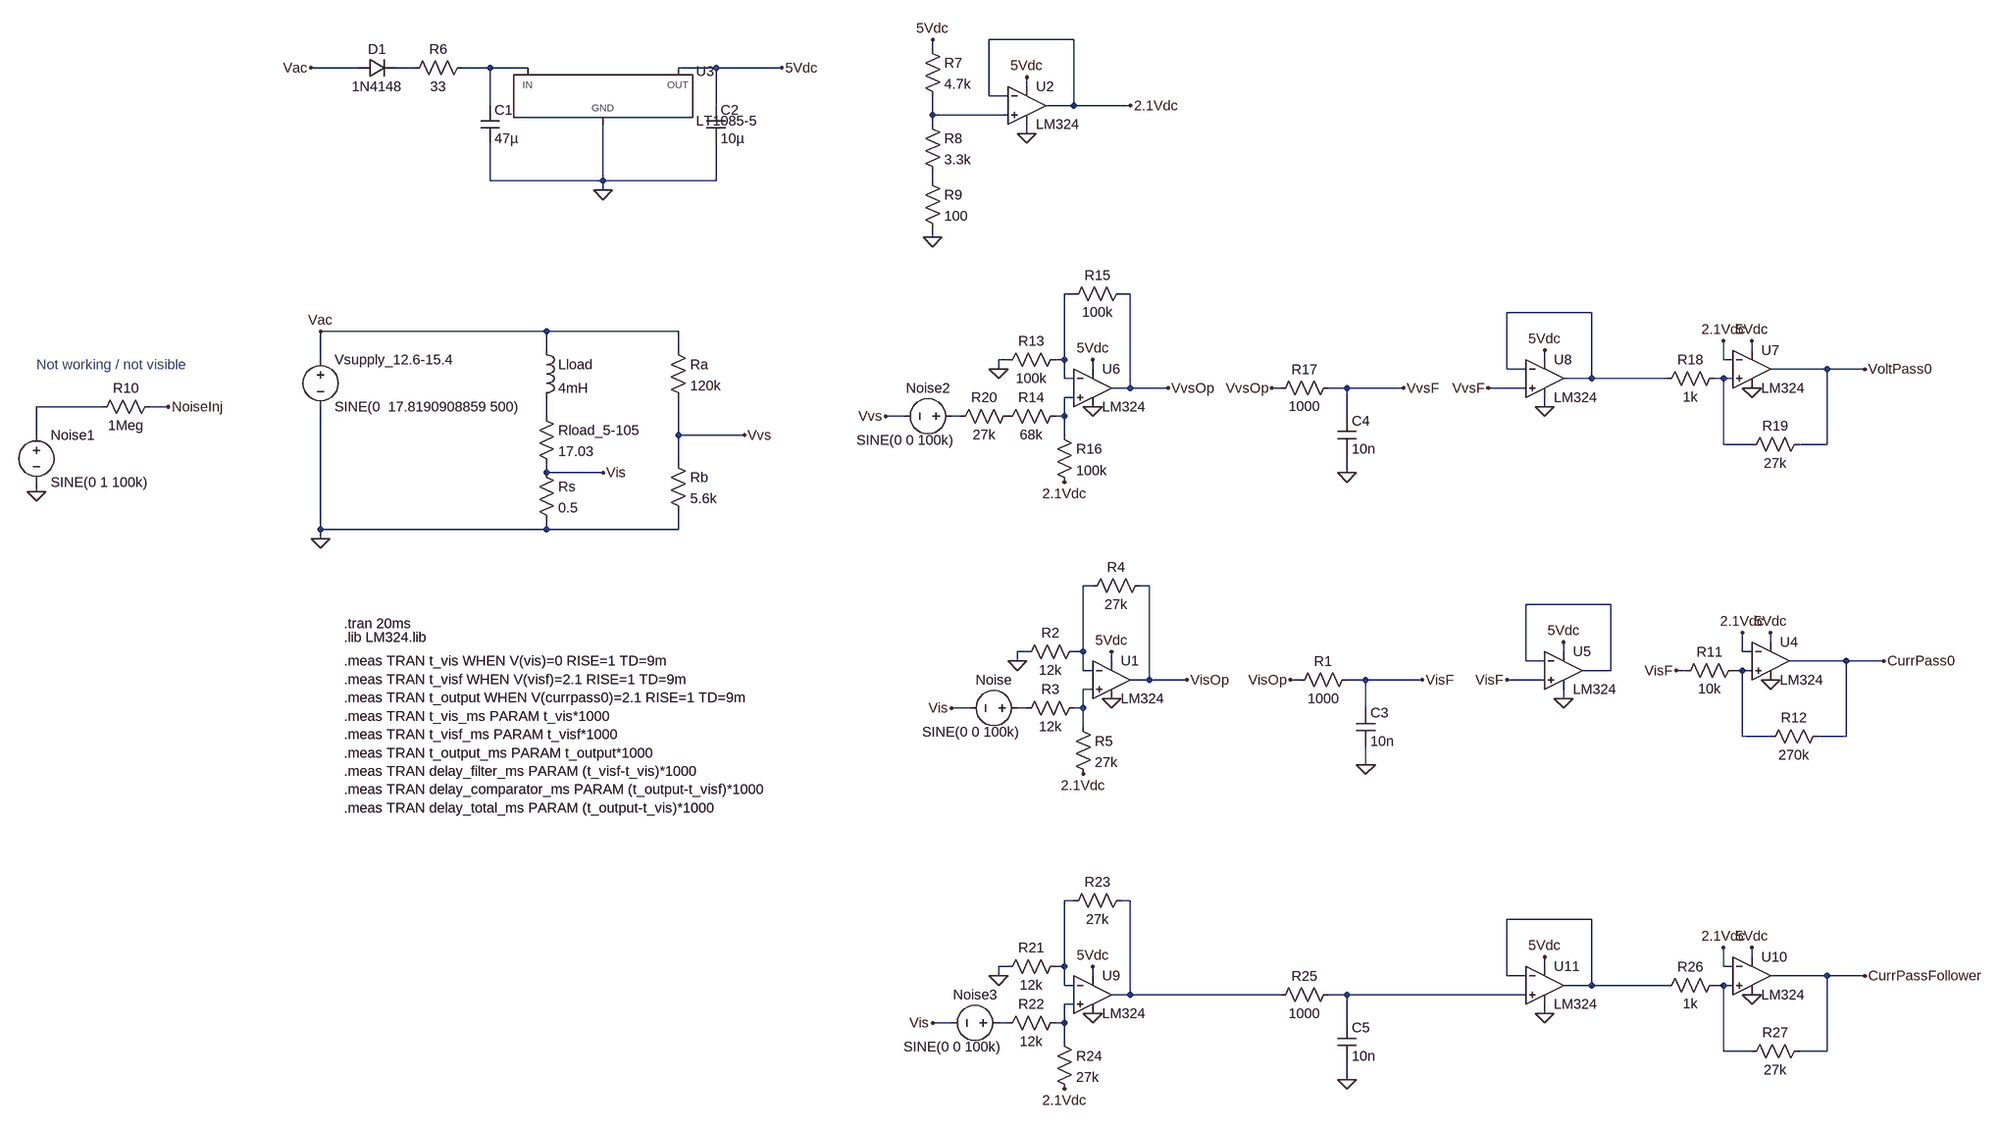
[diagram p0: schematic LTspice Simulation.asc]
LTspice Simulation.asc, the LTspice schematic file:
Version 4.1
SHEET 1 2524 1340
WIRE 960 -672 816 -672
WIRE 720 -656 720 -672
WIRE -256 -624 -336 -624
WIRE -160 -624 -192 -624
WIRE -32 -624 -80 -624
WIRE 32 -624 -32 -624
WIRE 352 -624 288 -624
WIRE 464 -624 352 -624
WIRE 880 -592 880 -608
WIRE 816 -576 816 -672
WIRE 848 -576 816 -576
WIRE -32 -560 -32 -624
WIRE 352 -560 352 -624
WIRE 960 -560 960 -672
WIRE 960 -560 912 -560
WIRE 1056 -560 960 -560
WIRE 720 -544 720 -576
WIRE 848 -544 720 -544
WIRE 720 -528 720 -544
WIRE 880 -512 880 -528
WIRE -32 -432 -32 -496
WIRE 160 -432 160 -528
WIRE 160 -432 -32 -432
WIRE 352 -432 352 -496
WIRE 352 -432 160 -432
WIRE 720 -432 720 -448
WIRE 160 -416 160 -432
WIRE 720 -336 720 -352
WIRE 960 -240 944 -240
WIRE 1056 -240 1040 -240
WIRE 1840 -208 1696 -208
WIRE 64 -176 -320 -176
WIRE 288 -176 64 -176
WIRE 64 -144 64 -176
WIRE 288 -144 288 -176
WIRE 2112 -144 2112 -160
WIRE -320 -128 -320 -176
WIRE 848 -128 832 -128
WIRE 944 -128 944 -240
WIRE 944 -128 928 -128
WIRE 1760 -128 1760 -144
WIRE 2064 -128 2064 -160
WIRE 2080 -128 2064 -128
WIRE 832 -112 832 -128
WIRE 992 -112 992 -128
WIRE 1696 -112 1696 -208
WIRE 1728 -112 1696 -112
WIRE 2240 -112 2144 -112
WIRE 2304 -112 2240 -112
WIRE 944 -96 944 -128
WIRE 960 -96 944 -96
WIRE 1840 -96 1840 -208
WIRE 1840 -96 1792 -96
WIRE 1968 -96 1840 -96
WIRE 2064 -96 2048 -96
WIRE 2080 -96 2064 -96
WIRE 1056 -80 1056 -240
WIRE 1056 -80 1024 -80
WIRE 1120 -80 1056 -80
WIRE 1312 -80 1296 -80
WIRE 1424 -80 1392 -80
WIRE 1520 -80 1424 -80
WIRE 1728 -80 1664 -80
WIRE 960 -64 944 -64
WIRE -1024 -48 -1136 -48
WIRE -912 -48 -944 -48
WIRE 1760 -48 1760 -64
WIRE 64 -32 64 -64
WIRE 672 -32 640 -32
WIRE 768 -32 752 -32
WIRE 944 -32 944 -64
WIRE 944 -32 928 -32
WIRE 1424 -32 1424 -80
WIRE -1136 0 -1136 -48
WIRE 288 0 288 -64
WIRE 400 0 288 0
WIRE 944 0 944 -32
WIRE 2064 16 2064 -96
WIRE 2112 16 2064 16
WIRE 2240 16 2240 -112
WIRE 2240 16 2192 16
WIRE 288 48 288 0
WIRE 64 64 64 48
WIRE 160 64 64 64
WIRE 1424 64 1424 32
WIRE -1136 96 -1136 80
WIRE -320 160 -320 -48
WIRE 64 160 64 144
WIRE 64 160 -320 160
WIRE 288 160 288 128
WIRE 288 160 64 160
WIRE -320 176 -320 160
WIRE 992 256 976 256
WIRE 1088 256 1072 256
WIRE 1872 288 1728 288
WIRE 2144 352 2144 336
WIRE 880 368 864 368
WIRE 976 368 976 256
WIRE 976 368 960 368
WIRE 1792 368 1792 352
WIRE 2096 368 2096 336
WIRE 2112 368 2096 368
WIRE 864 384 864 368
WIRE 1024 384 1024 368
WIRE 1728 384 1728 288
WIRE 1760 384 1728 384
WIRE 2272 384 2176 384
WIRE 2336 384 2272 384
WIRE 976 400 976 368
WIRE 992 400 976 400
WIRE 1872 400 1872 288
WIRE 1872 400 1824 400
WIRE 2000 400 1984 400
WIRE 2096 400 2080 400
WIRE 2112 400 2096 400
WIRE 1088 416 1088 256
WIRE 1088 416 1056 416
WIRE 1152 416 1088 416
WIRE 1344 416 1328 416
WIRE 1456 416 1424 416
WIRE 1552 416 1456 416
WIRE 1760 416 1696 416
WIRE 992 432 976 432
WIRE 1792 448 1792 432
WIRE 784 464 752 464
WIRE 880 464 864 464
WIRE 976 464 976 432
WIRE 976 464 960 464
WIRE 1456 464 1456 416
WIRE 976 496 976 464
WIRE 2096 512 2096 400
WIRE 2144 512 2096 512
WIRE 2272 512 2272 384
WIRE 2272 512 2224 512
WIRE 1456 560 1456 528
WIRE 960 896 944 896
WIRE 1056 896 1040 896
WIRE 1840 928 1696 928
WIRE 2112 992 2112 976
WIRE 848 1008 832 1008
WIRE 944 1008 944 896
WIRE 944 1008 928 1008
WIRE 1760 1008 1760 992
WIRE 2064 1008 2064 976
WIRE 2080 1008 2064 1008
WIRE 832 1024 832 1008
WIRE 992 1024 992 1008
WIRE 1696 1024 1696 928
WIRE 1728 1024 1696 1024
WIRE 2240 1024 2144 1024
WIRE 2304 1024 2240 1024
WIRE 944 1040 944 1008
WIRE 960 1040 944 1040
WIRE 1840 1040 1840 928
WIRE 1840 1040 1792 1040
WIRE 1968 1040 1840 1040
WIRE 2064 1040 2048 1040
WIRE 2080 1040 2064 1040
WIRE 1056 1056 1056 896
WIRE 1056 1056 1024 1056
WIRE 1312 1056 1056 1056
WIRE 1424 1056 1392 1056
WIRE 1728 1056 1424 1056
WIRE 960 1072 944 1072
WIRE 1760 1088 1760 1072
WIRE 752 1104 720 1104
WIRE 848 1104 832 1104
WIRE 944 1104 944 1072
WIRE 944 1104 928 1104
WIRE 1424 1104 1424 1056
WIRE 944 1136 944 1104
WIRE 2064 1152 2064 1040
WIRE 2112 1152 2064 1152
WIRE 2240 1152 2240 1024
WIRE 2240 1152 2192 1152
WIRE 1424 1200 1424 1168
FLAG 160 64 Vis
FLAG 400 0 Vvs
FLAG -320 176 0
FLAG -320 -176 Vac
FLAG -336 -624 Vac
FLAG 464 -624 5Vdc
FLAG 160 -416 0
FLAG 1024 368 5Vdc
FLAG 864 384 0
FLAG 752 464 Vis
FLAG 720 -336 0
FLAG 976 576 2.1Vdc
FLAG 1024 448 0
FLAG 720 -672 5Vdc
FLAG 880 -608 5Vdc
FLAG 880 -512 0
FLAG 1056 -560 2.1Vdc
FLAG 1456 560 0
FLAG 1552 416 VisF
FLAG -1136 96 0
FLAG -912 -48 NoiseInj
FLAG 1152 416 VisOp
FLAG 1328 416 VisOp
FLAG 2144 416 0
FLAG 2144 336 5Vdc
FLAG 2096 336 2.1Vdc
FLAG 2336 384 CurrPass0
FLAG 1792 352 5Vdc
FLAG 1792 448 0
FLAG 1696 416 VisF
FLAG 992 -128 5Vdc
FLAG 832 -112 0
FLAG 640 -32 Vvs
FLAG 944 80 2.1Vdc
FLAG 992 -48 0
FLAG 1424 64 0
FLAG 1520 -80 VvsF
FLAG 1120 -80 VvsOp
FLAG 1296 -80 VvsOp
FLAG 2112 -80 0
FLAG 2112 -160 5Vdc
FLAG 2064 -160 2.1Vdc
FLAG 2304 -112 VoltPass0
FLAG 1760 -144 5Vdc
FLAG 1760 -48 0
FLAG 1664 -80 VvsF
FLAG 1984 400 VisF
FLAG 992 1008 5Vdc
FLAG 832 1024 0
FLAG 720 1104 Vis
FLAG 944 1216 2.1Vdc
FLAG 992 1088 0
FLAG 1424 1200 0
FLAG 2112 1056 0
FLAG 2112 976 5Vdc
FLAG 2064 976 2.1Vdc
FLAG 2304 1024 CurrPassFollower
FLAG 1760 992 5Vdc
FLAG 1760 1088 0
SYMBOL voltage -320 -144 R0
WINDOW 123 0 0 Left 0
WINDOW 39 0 0 Left 0
SYMATTR InstName Vsupply_12.6-15.4
SYMATTR Value SINE(0  17.8190908859 500)
SYMBOL ind 48 -160 R0
SYMATTR InstName Lload
SYMATTR Value 4mH
SYMATTR SpiceLine Rser=1m
SYMBOL res 48 -48 R0
SYMATTR InstName Rload_5-105
SYMATTR Value 17.03
SYMBOL res 272 -160 R0
SYMATTR InstName Ra
SYMATTR Value 120k
SYMBOL res 272 32 R0
SYMATTR InstName Rb
SYMATTR Value 5.6k
SYMBOL res 48 48 R0
SYMATTR InstName Rs
SYMATTR Value 0.5
SYMBOL res 976 352 R90
WINDOW 0 0 56 VBottom 2
WINDOW 3 32 56 VTop 2
SYMATTR InstName R2
SYMATTR Value 12k
SYMBOL res 976 448 R90
WINDOW 0 0 56 VBottom 2
WINDOW 3 32 56 VTop 2
SYMATTR InstName R3
SYMATTR Value 12k
SYMBOL res 1088 240 R90
WINDOW 0 0 56 VBottom 2
WINDOW 3 32 56 VTop 2
SYMATTR InstName R4
SYMATTR Value 27k
SYMBOL res 960 480 R0
SYMATTR InstName R5
SYMATTR Value 27k
SYMBOL diode -256 -608 R270
WINDOW 0 32 32 VTop 2
WINDOW 3 0 32 VBottom 2
SYMATTR InstName D1
SYMATTR Value 1N4148
SYMBOL res -64 -640 R90
WINDOW 0 0 56 VBottom 2
WINDOW 3 32 56 VTop 2
SYMATTR InstName R6
SYMATTR Value 33
SYMBOL cap -48 -560 R0
SYMATTR InstName C1
SYMATTR Value 47µ
SYMBOL cap 336 -560 R0
SYMATTR InstName C2
SYMATTR Value 10µ
SYMBOL PowerProducts\\LT1085-5 160 -624 R0
SYMATTR InstName U3
SYMBOL res 704 -672 R0
SYMATTR InstName R7
SYMATTR Value 4.7k
SYMBOL res 704 -544 R0
SYMATTR InstName R8
SYMATTR Value 3.3k
SYMBOL OpAmps\\opamp2 1024 352 R0
SYMATTR InstName U1
SYMATTR Value LM324
SYMBOL res 704 -448 R0
SYMATTR InstName R9
SYMATTR Value 100
SYMBOL OpAmps\\opamp2 880 -624 R0
SYMATTR InstName U2
SYMATTR Value LM324
SYMBOL res 1440 400 R90
WINDOW 0 0 56 VBottom 2
WINDOW 3 32 56 VTop 2
SYMATTR InstName R1
SYMATTR Value 1000
SYMBOL cap 1440 464 R0
SYMATTR InstName C3
SYMATTR Value 10n
SYMBOL voltage -1136 -16 R0
WINDOW 123 0 0 Left 0
WINDOW 39 0 0 Left 0
SYMATTR InstName Noise1
SYMATTR Value SINE(0 1 100k)
SYMBOL res -928 -64 R90
WINDOW 0 0 56 VBottom 2
WINDOW 3 32 56 VTop 2
SYMATTR InstName R10
SYMATTR Value 1Meg
SYMBOL voltage 880 464 R90
WINDOW 0 -32 56 VBottom 2
WINDOW 3 56 95 VBottom 2
WINDOW 123 0 0 Left 0
WINDOW 39 0 0 Left 0
SYMATTR InstName Noise
SYMATTR Value SINE(0 0 100k)
SYMBOL OpAmps\\opamp2 2144 320 R0
SYMATTR InstName U4
SYMATTR Value LM324
SYMBOL res 2096 384 R90
WINDOW 0 0 56 VBottom 2
WINDOW 3 32 56 VTop 2
SYMATTR InstName R11
SYMATTR Value 10k
SYMBOL res 2240 496 R90
WINDOW 0 0 56 VBottom 2
WINDOW 3 32 56 VTop 2
SYMATTR InstName R12
SYMATTR Value 270k
SYMBOL OpAmps\\opamp2 1792 336 R0
SYMATTR InstName U5
SYMATTR Value LM324
SYMBOL res 944 -144 R90
WINDOW 0 0 56 VBottom 2
WINDOW 3 32 56 VTop 2
SYMATTR InstName R13
SYMATTR Value 100k
SYMBOL res 944 -48 R90
WINDOW 0 0 56 VBottom 2
WINDOW 3 32 56 VTop 2
SYMATTR InstName R14
SYMATTR Value 68k
SYMBOL res 1056 -256 R90
WINDOW 0 0 56 VBottom 2
WINDOW 3 32 56 VTop 2
SYMATTR InstName R15
SYMATTR Value 100k
SYMBOL res 928 -16 R0
SYMATTR InstName R16
SYMATTR Value 100k
SYMBOL OpAmps\\opamp2 992 -144 R0
SYMATTR InstName U6
SYMATTR Value LM324
SYMBOL res 1408 -96 R90
WINDOW 0 0 56 VBottom 2
WINDOW 3 32 56 VTop 2
SYMATTR InstName R17
SYMATTR Value 1000
SYMBOL cap 1408 -32 R0
SYMATTR InstName C4
SYMATTR Value 10n
SYMBOL voltage 768 -32 R90
WINDOW 0 -32 56 VBottom 2
WINDOW 3 56 95 VBottom 2
WINDOW 123 0 0 Left 0
WINDOW 39 0 0 Left 0
SYMATTR InstName Noise2
SYMATTR Value SINE(0 0 100k)
SYMBOL OpAmps\\opamp2 2112 -176 R0
SYMATTR InstName U7
SYMATTR Value LM324
SYMBOL res 2064 -112 R90
WINDOW 0 0 56 VBottom 2
WINDOW 3 32 56 VTop 2
SYMATTR InstName R18
SYMATTR Value 1k
SYMBOL res 2208 0 R90
WINDOW 0 0 56 VBottom 2
WINDOW 3 32 56 VTop 2
SYMATTR InstName R19
SYMATTR Value 27k
SYMBOL OpAmps\\opamp2 1760 -160 R0
SYMATTR InstName U8
SYMATTR Value LM324
SYMBOL res 864 -48 R90
WINDOW 0 0 56 VBottom 2
WINDOW 3 32 56 VTop 2
SYMATTR InstName R20
SYMATTR Value 27k
SYMBOL res 944 992 R90
WINDOW 0 0 56 VBottom 2
WINDOW 3 32 56 VTop 2
SYMATTR InstName R21
SYMATTR Value 12k
SYMBOL res 944 1088 R90
WINDOW 0 0 56 VBottom 2
WINDOW 3 32 56 VTop 2
SYMATTR InstName R22
SYMATTR Value 12k
SYMBOL res 1056 880 R90
WINDOW 0 0 56 VBottom 2
WINDOW 3 32 56 VTop 2
SYMATTR InstName R23
SYMATTR Value 27k
SYMBOL res 928 1120 R0
SYMATTR InstName R24
SYMATTR Value 27k
SYMBOL OpAmps\\opamp2 992 992 R0
SYMATTR InstName U9
SYMATTR Value LM324
SYMBOL res 1408 1040 R90
WINDOW 0 0 56 VBottom 2
WINDOW 3 32 56 VTop 2
SYMATTR InstName R25
SYMATTR Value 1000
SYMBOL cap 1408 1104 R0
SYMATTR InstName C5
SYMATTR Value 10n
SYMBOL voltage 848 1104 R90
WINDOW 0 -32 56 VBottom 2
WINDOW 3 56 95 VBottom 2
WINDOW 123 0 0 Left 0
WINDOW 39 0 0 Left 0
SYMATTR InstName Noise3
SYMATTR Value SINE(0 0 100k)
SYMBOL OpAmps\\opamp2 2112 960 R0
SYMATTR InstName U10
SYMATTR Value LM324
SYMBOL res 2064 1024 R90
WINDOW 0 0 56 VBottom 2
WINDOW 3 32 56 VTop 2
SYMATTR InstName R26
SYMATTR Value 1k
SYMBOL res 2208 1136 R90
WINDOW 0 0 56 VBottom 2
WINDOW 3 32 56 VTop 2
SYMATTR InstName R27
SYMATTR Value 27k
SYMBOL OpAmps\\opamp2 1760 976 R0
SYMATTR InstName U11
SYMATTR Value LM324
TEXT -280 320 Left 2 !.tran 20ms
TEXT -280 344 Left 2 !.lib LM324.lib
TEXT -1136 -120 Left 2 ;Not working / not visible
TEXT -280 384 Left 2 !.meas TRAN t_vis WHEN V(vis)=0 RISE=1 TD=9m\n.meas TRAN t_visf WHEN V(visf)=2.1 RISE=1 TD=9m\n.meas TRAN t_output WHEN V(currpass0)=2.1 RISE=1 TD=9m\n.meas TRAN t_vis_ms PARAM t_vis*1000\n.meas TRAN t_visf_ms PARAM t_visf*1000\n.meas TRAN t_output_ms PARAM t_output*1000\n.meas TRAN delay_filter_ms PARAM (t_visf-t_vis)*1000\n.meas TRAN delay_comparator_ms PARAM (t_output-t_visf)*1000\n.meas TRAN delay_total_ms PARAM (t_output-t_vis)*1000

The netlist it stands for:
* LTspice Simulation.asc
Vsupply_12.6-15.4 Vac 0 SINE(0  17.8190908859 500)
Lload Vac N010 4mH Rser=1m
Rload_5-105 N010 Vis 17.03
Ra Vac Vvs 120k
Rb Vvs 0 5.6k
Rs Vis 0 0.5
R2 N012 0 12k
R3 N015 N016 12k
R4 VisOp N012 27k
R5 N015 2.1Vdc 27k
D1 Vac N001 1N4148
R6 N002 N001 33
C1 N002 0 47µ
C2 5Vdc 0 10µ
X§U3 0 5Vdc N002 LT1085-5  ; pins GND OUT IN
R7 5Vdc N003 4.7k
R8 N003 N004 3.3k
X§U1 N015 N012 5Vdc 0 VisOp LM324  ; pins In+ In- V+ V- OUT
R9 N004 0 100
X§U2 N003 2.1Vdc 5Vdc 0 2.1Vdc LM324  ; pins In+ In- V+ V- OUT
R1 VisF VisOp 1000
C3 VisF 0 10n
V§Noise1 N009 0 SINE(0 1 100k)
R10 NoiseInj N009 1Meg
V§Noise N016 Vis SINE(0 0 100k)
X§U4 N014 2.1Vdc 5Vdc 0 CurrPass0 LM324  ; pins In+ In- V+ V- OUT
R11 N014 VisF 10k
R12 CurrPass0 N014 270k
X§U5 VisF N013 5Vdc 0 N013 LM324  ; pins In+ In- V+ V- OUT
R13 N005 0 100k
R14 N008 P001 68k
R15 VvsOp N005 100k
R16 N008 2.1Vdc 100k
X§U6 N008 N005 5Vdc 0 VvsOp LM324  ; pins In+ In- V+ V- OUT
R17 VvsF VvsOp 1000
C4 VvsF 0 10n
V§Noise2 N011 Vvs SINE(0 0 100k)
X§U7 N007 2.1Vdc 5Vdc 0 VoltPass0 LM324  ; pins In+ In- V+ V- OUT
R18 N007 N006 1k
R19 VoltPass0 N007 27k
X§U8 VvsF N006 5Vdc 0 N006 LM324  ; pins In+ In- V+ V- OUT
R20 P001 N011 27k
R21 N017 0 12k
R22 N022 N023 12k
R23 N018 N017 27k
R24 N022 2.1Vdc 27k
X§U9 N022 N017 5Vdc 0 N018 LM324  ; pins In+ In- V+ V- OUT
R25 N021 N018 1000
C5 N021 0 10n
V§Noise3 N023 Vis SINE(0 0 100k)
X§U10 N020 2.1Vdc 5Vdc 0 CurrPassFollower LM324  ; pins In+ In- V+ V- OUT
R26 N020 N019 1k
R27 CurrPassFollower N020 27k
X§U11 N021 N019 5Vdc 0 N019 LM324  ; pins In+ In- V+ V- OUT
.model D D
.lib standard.dio
.tran 20ms
.lib LM324.lib
* Not working / not visible
.meas TRAN t_vis WHEN V(vis)=0 RISE=1 TD=9m
.meas TRAN t_visf WHEN V(visf)=2.1 RISE=1 TD=9m
.meas TRAN t_output WHEN V(currpass0)=2.1 RISE=1 TD=9m
.meas TRAN t_vis_ms PARAM t_vis*1000
.meas TRAN t_visf_ms PARAM t_visf*1000
.meas TRAN t_output_ms PARAM t_output*1000
.meas TRAN delay_filter_ms PARAM (t_visf-t_vis)*1000
.meas TRAN delay_comparator_ms PARAM (t_output-t_visf)*1000
.meas TRAN delay_total_ms PARAM (t_output-t_vis)*1000
.backanno
.end